# EAGLE schematic GPS_radiologger_v24_L70_CMWX_MAX_v9 (EAGLE 9.7.0)
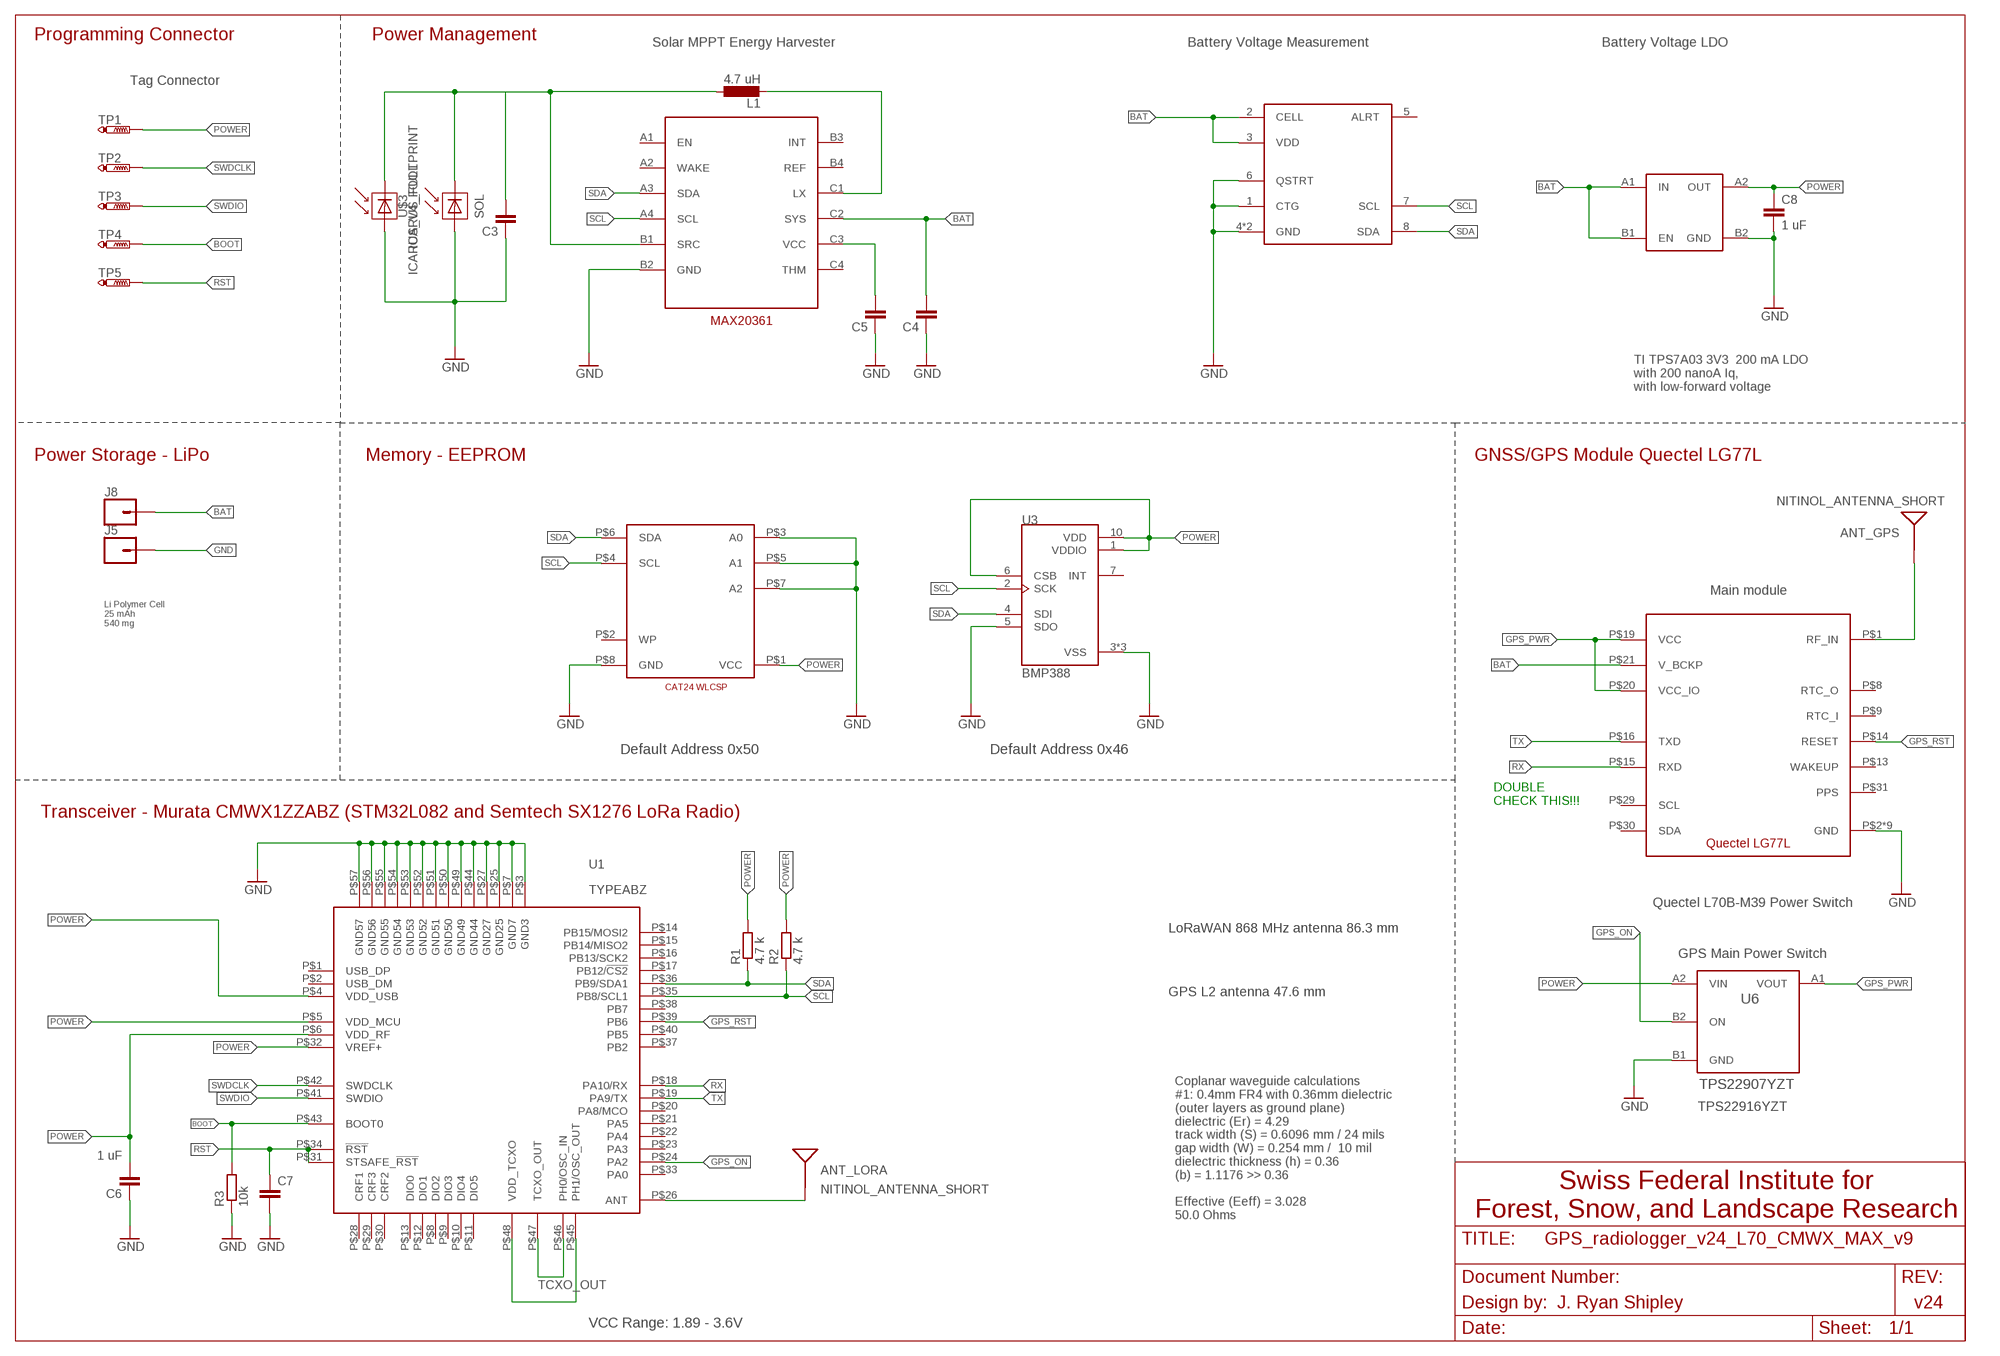
[diagram p0: schematic, sheet 1]

## Parts
ANT_GPS  NITINOL_ANTENNA_SHORT  [ICARUS_NITINOL_ANTENNA_SHORT]
ANT_LORA  NITINOL_ANTENNA_SHORT  [ICARUS_NITINOL_ANTENNA_SHORT]
C3  10UF  [0603-TIGHT]
C4  1.0UF  [0402-TIGHTER]
C5  1.0UF  [0402-TIGHTER]
C6  1 uF  1.0UF  [0402-TIGHTER]
C7  C-EUC0201  [C0201]
C8  1 uF  1.0UF  [0402-TIGHTER]
J5  CONN_01PTH_NO_SILK_SMALL  [1X01_SMALL]
J8  CONN_01PTH_NO_SILK_SMALL  [1X01_SMALL]
L1  4.7 uH  IND_2016  [INDC2016X120L]
R1  4.7 k  R-EU_R0201  [R0201]
R2  4.7 k  R-EU_R0201  [R0201]
R3  10k  R-EU_R0201  [R0201]
SOL  ICARUS_V4_FOOTPRINT  [ICARUS_FULL_FOOTPRINT]
TP1  PTR1TP08SQ  [TP08SQ]
TP2  PTR1TP08SQ  [TP08SQ]
TP3  PTR1TP08SQ  [TP08SQ]
TP4  PTR1TP08SQ  [TP08SQ]
TP5  PTR1TP08SQ  [TP08SQ]
U1  TYPEABZ  [TYPEABZ]
U3  BMP388  [PQFN50P200X200X80-10N]
U4  TPS7A03-DSBGA  [BGA4N35P2X2_70X70X40N]
U6  TPS22907YZT  [YFP0004-DSBGA]
U7  CAT24_WLCSP8  [WLCSP8]
U8  MAX20361  [BGA12N40P4X3_123X163X64N]
U$1  LG77L  [LG77L]
U$2  MAX17048G+  [SON50P200X200X75-9T80X120L]
U$3  ICARUS_FULL  [ICARUS_FULL]

## Nets
BAT [battery]: C4.P$2 J8.P$1 U4.A1(IN) U4.B1(EN) U8.C2(SYS) U$1.P$21(V_BCKP) U$2.2(CELL) U$2.3(VDD)
BOOT: R3.2 TP4.TP U1.P$43(BOOT0)
GND: C3.P$1 C4.P$1 C5.P$1 C6.P$1 C7.2 C8.P$2 J5.P$1 R3.1 SOL.P$2(MINUS) U1.P$3(GND3) U1.P$7(GND7) U1.P$25(GND25) U1.P$27(GND27) U1.P$44(GND44) U1.P$49(GND49) U1.P$50(GND50) U1.P$51(GND51) U1.P$52(GND52) U1.P$53(GND53) U1.P$54(GND54) U1.P$55(GND55) U1.P$56(GND56) U1.P$57(GND57) U3.3(VSS) U3.5(SDO) U3.8(VSS) U3.9(VSS) U4.B2(GND) U6.B1(GND) U7.P$3(A0) U7.P$5(A1) U7.P$7(A2) U7.P$8(GND) U8.B2(GND) U$1.P$2(GND) U$1.P$18(GND) U$1.P$37(GND) U$1.P$38(GND) U$1.P$39(GND) U$1.P$40(GND) U$1.P$41(GND) U$1.P$42(GND) U$1.P$43(GND) U$2.1(CTG) U$2.4(GND) U$2.6(QSTRT) U$2.9(GND) U$3.P$2(MINUS)
GPS_ON: U1.P$24(PA2) U6.B2(ON)
GPS_PWR: U6.A1(VOUT) U$1.P$19(VCC) U$1.P$20(VCC_IO)
GPS_RST: U1.P$39(PB6) U$1.P$14(RESET)
N$1: U1.P$45(PH1/OSC_OUT) U1.P$48(VDD_TCXO)
N$2 [antenna]: ANT_GPS.1(SIGNAL) ANT_GPS.2(SIGNAL) ANT_GPS.3(SIGNAL) U$1.P$1(RF_IN)
N$3: L1.2 U8.C1(LX)
N$4: C5.P$2 U8.C3(VCC)
N$11 [antenna]: ANT_LORA.1(SIGNAL) ANT_LORA.2(SIGNAL) ANT_LORA.3(SIGNAL) U1.P$26(ANT)
N$15 [battery]: C3.P$2 L1.1 SOL.P$1(PLUS) U8.B1(SRC) U$3.P$1(PLUS)
POWER [power]: C6.P$2 C8.P$1 R1.2 R2.2 TP1.TP U1.P$4(VDD_USB) U1.P$5(VDD_MCU) U1.P$6(VDD_RF) U1.P$32(VREF+) U3.1(VDDIO) U3.6(CSB) U3.10(VDD) U4.A2(OUT) U6.A2(VIN) U7.P$1(VCC)
RST: C7.1 TP5.TP U1.P$31(STSAFE_!RST) U1.P$34(!RST)
RX: U1.P$18(PA10/RX) U$1.P$15(RXD)
SCL: R2.1 U1.P$35(PB8/SCL1) U3.2(SCK) U7.P$4(SCL) U8.A4(SCL) U$2.7(SCL)
SDA: R1.1 U1.P$36(PB9/SDA1) U3.4(SDI) U7.P$6(SDA) U8.A3(SDA) U$2.8(SDA)
SWDCLK: TP2.TP U1.P$42(SWDCLK)
SWDIO: TP3.TP U1.P$41(SWDIO)
TCXO_OUT: U1.P$46(PH0/OSC_IN) U1.P$47(TCXO_OUT)
TX: U1.P$19(PA9/TX) U$1.P$16(TXD)
Unconnected: U1.P$1(USB_DP) U1.P$2(USB_DM) U1.P$8(DIO2) U1.P$9(DIO3) U1.P$10(DIO4) U1.P$11(DIO5) U1.P$12(DIO1) U1.P$13(DIO0) U1.P$14(PB15/MOSI2) U1.P$15(PB14/MISO2) U1.P$16(PB13/SCK2) U1.P$17(PB12/!CS2) U1.P$20(PA8/MCO) U1.P$21(PA5) U1.P$22(PA4) U1.P$23(PA3) U1.P$28(CRF1) U1.P$29(CRF3) U1.P$30(CRF2) U1.P$33(PA0) U1.P$37(PB2) U1.P$38(PB7) U1.P$40(PB5) U3.7(INT) U7.P$2(WP) U8.A1(EN) U8.A2(WAKE) U8.B3(INT) U8.B4(REF) U8.C4(THM) U$1.P$8(RTC_O) U$1.P$9(RTC_I) U$1.P$13(WAKEUP) U$1.P$29(SCL) U$1.P$30(SDA) U$1.P$31(PPS) U$2.5(ALRT)

## Notes on the sheet
- Programming Connector | Power Management
- Solar MPPT Energy Harvester | Battery Voltage Measurement | Battery Voltage LDO
- Tag Connector
- TI TPS7A03 3V3  200 mA LDO
  with 200 nanoA Iq, 
  with low-forward voltage
- Power Storage - LiPo | Memory - EEPROM | GNSS/GPS Module Quectel LG77L
- Main module
- Li Polymer Cell
  25 mAh
  540 mg
- Default Address 0x50 | Default Address 0x46
- DOUBLE 
  CHECK THIS!!!
- Transceiver - Murata CMWX1ZZABZ (STM32L082 and Semtech SX1276 LoRa Radio)
- Quectel L70B-M39 Power Switch
- LoRaWAN 868 MHz antenna 86.3 mm
- GPS Main Power Switch
- GPS L2 antenna 47.6 mm
- TPS22916YZT
- Swiss Federal Institute for
  Forest, Snow, and Landscape Research
- Coplanar waveguide calculations
  #1: 0.4mm FR4 with 0.36mm dielectric 
  (outer layers as ground plane)
  dielectric (Er) = 4.29
  track width (S) = 0.6096 mm / 24 mils
  gap width (W) = 0.254 mm /  10 mil
  dielectric thickness (h) = 0.36
  (b) = 1.1176 >> 0.36
  
  Effective (Eeff) = 3.028
  50.0 Ohms
- Design by: | J. Ryan Shipley | v24
- VCC Range: 1.89 - 3.6V

## Library data of the parts
ANT_GPS ANT_LORA = Antenna_mounts:NITINOL_ANTENNA_SHORT
C3 = SparkFun-Capacitors:10UF: 10.0µF ceramic capacitors A capacitor is a passive two-terminal electrical component used to store electrical energy temporarily in an electric field.
C4-C6 C8 = SparkFun-Capacitors:1.0UF: 1µF ceramic capacitors A capacitor is a passive two-terminal electrical component used to store electrical energy temporarily in an electric field.
C7 = rcl:C-EU: CAPACITOR, European symbol; SPICEPREFIX: C
J5 J8 = SparkFun-Connectors:CONN_01: Single connection point. Often used as Generic Header-pin footprint for 0.1 inch spaced/style header connections On any of the 0.1 inch spaced packages, you can populate with these: Break Away Headers - Straight <https://www.sparkfun.com/products/116> (PRT-00116) Break Away Male Headers - Right Angle <https://www.sparkfun.com/products/553> (PRT-00553) Female Headers <https://www.sparkfun.com/products/115> (PRT-00115) Break Away Headers - Machine Pin <https://www.sparkfun.com/products/117> (PRT-00117) Break Away Female Headers - Swiss Machine Pin <https://www.sparkfun.com/products/743> (PRT-00743) This device is also useful as a general connection point to wire up your design to another part of your project. Our various solder wires solder well into these plated through hole pads. Hook-Up Wire - Assortment (Stranded, 22 AWG) <https://www.sparkfun.com/products/11375> (PRT-11375) Hook-Up Wire - Assortment (Solid Core, 22 AWG) <https://www.sparkfun.com/products/11367> (PRT-11367) View the entire wire category on our website here <https://www.sparkfun.com/categories/141> Special notes: SMTSO-256-ET is a "flush mount" nut for a 4-40 screw. We mostly use this on specialty testbeds; it is a nice way to connect hardware to your PCB at an adjustable hieght. Also note, the SNAP packages are for using a snappable style connector. We sell a baggie of snaps and they are also used on two LilyPad designs: Snap Assortment - 30 pack (male and female) <https://www.sparkfun.com/products/11347> (DEV-11347) LilyPad Arduino SimpleSnap <https://www.sparkfun.com/products/10941> (DEV-10941) LilyPad SimpleSnap Protoboard <https://www.sparkfun.com/products/10940> (DEV-10940)
L1 = Ryan_custom:IND_2016
R1-R3 = rcl:R-EU_: RESISTOR, European symbol; SPICEPREFIX: R
SOL = TrisolX_Solar_Cells:ICARUS_V4_FOOTPRINT
TP1-TP5 = testpad:PTR1: TEST PIN
U1 = Kris:TYPEABZ: CMWX1ZZABZ-078
U3 = BMP388:BMP388: P-Sensor SPI I2C 1, 25 Bar SMD; AVAILABILITY: Unavailable; DESCRIPTION: Pressure Sensor 4.35PSI ~ 18.13PSI (30kPa ~ 125kPa) Absolute 10-WFLGA; MF: Bosch Sensortec; MP: BMP388; PACKAGE: WFLGA-10 Bosch Tools; PRICE: None
U4 = Ryan_custom:TPS7A03-DSBGA
U6 = TPS22916:TPS22907YZT
U7 = Ryan_custom:CAT24_WLCSP8
U8 = Ryan_custom:MAX20361
U$1 = Quectel:LG77L
U$2 = Ryan_custom:MAX17048G+
U$3 = TrisolX_Solar_Cells:ICARUS_FULL

## Net classes
0 default: width 0.254 mm
1 power: width 0.305 mm
2 antenna: width 0.61 mm, clearance 0.305 mm
3 battery: width 0.254 mm
4 diff_pair: width 0.178 mm, clearance 0.152 mm